# EasyEDA schematic Nixie Clock Main Board.json
TITLE: Sheet_1; REV: 1.0; Date: 2021-07-18; Sheet: 1/1; Drawn By: Gustavo Moraes; Company: Your Company
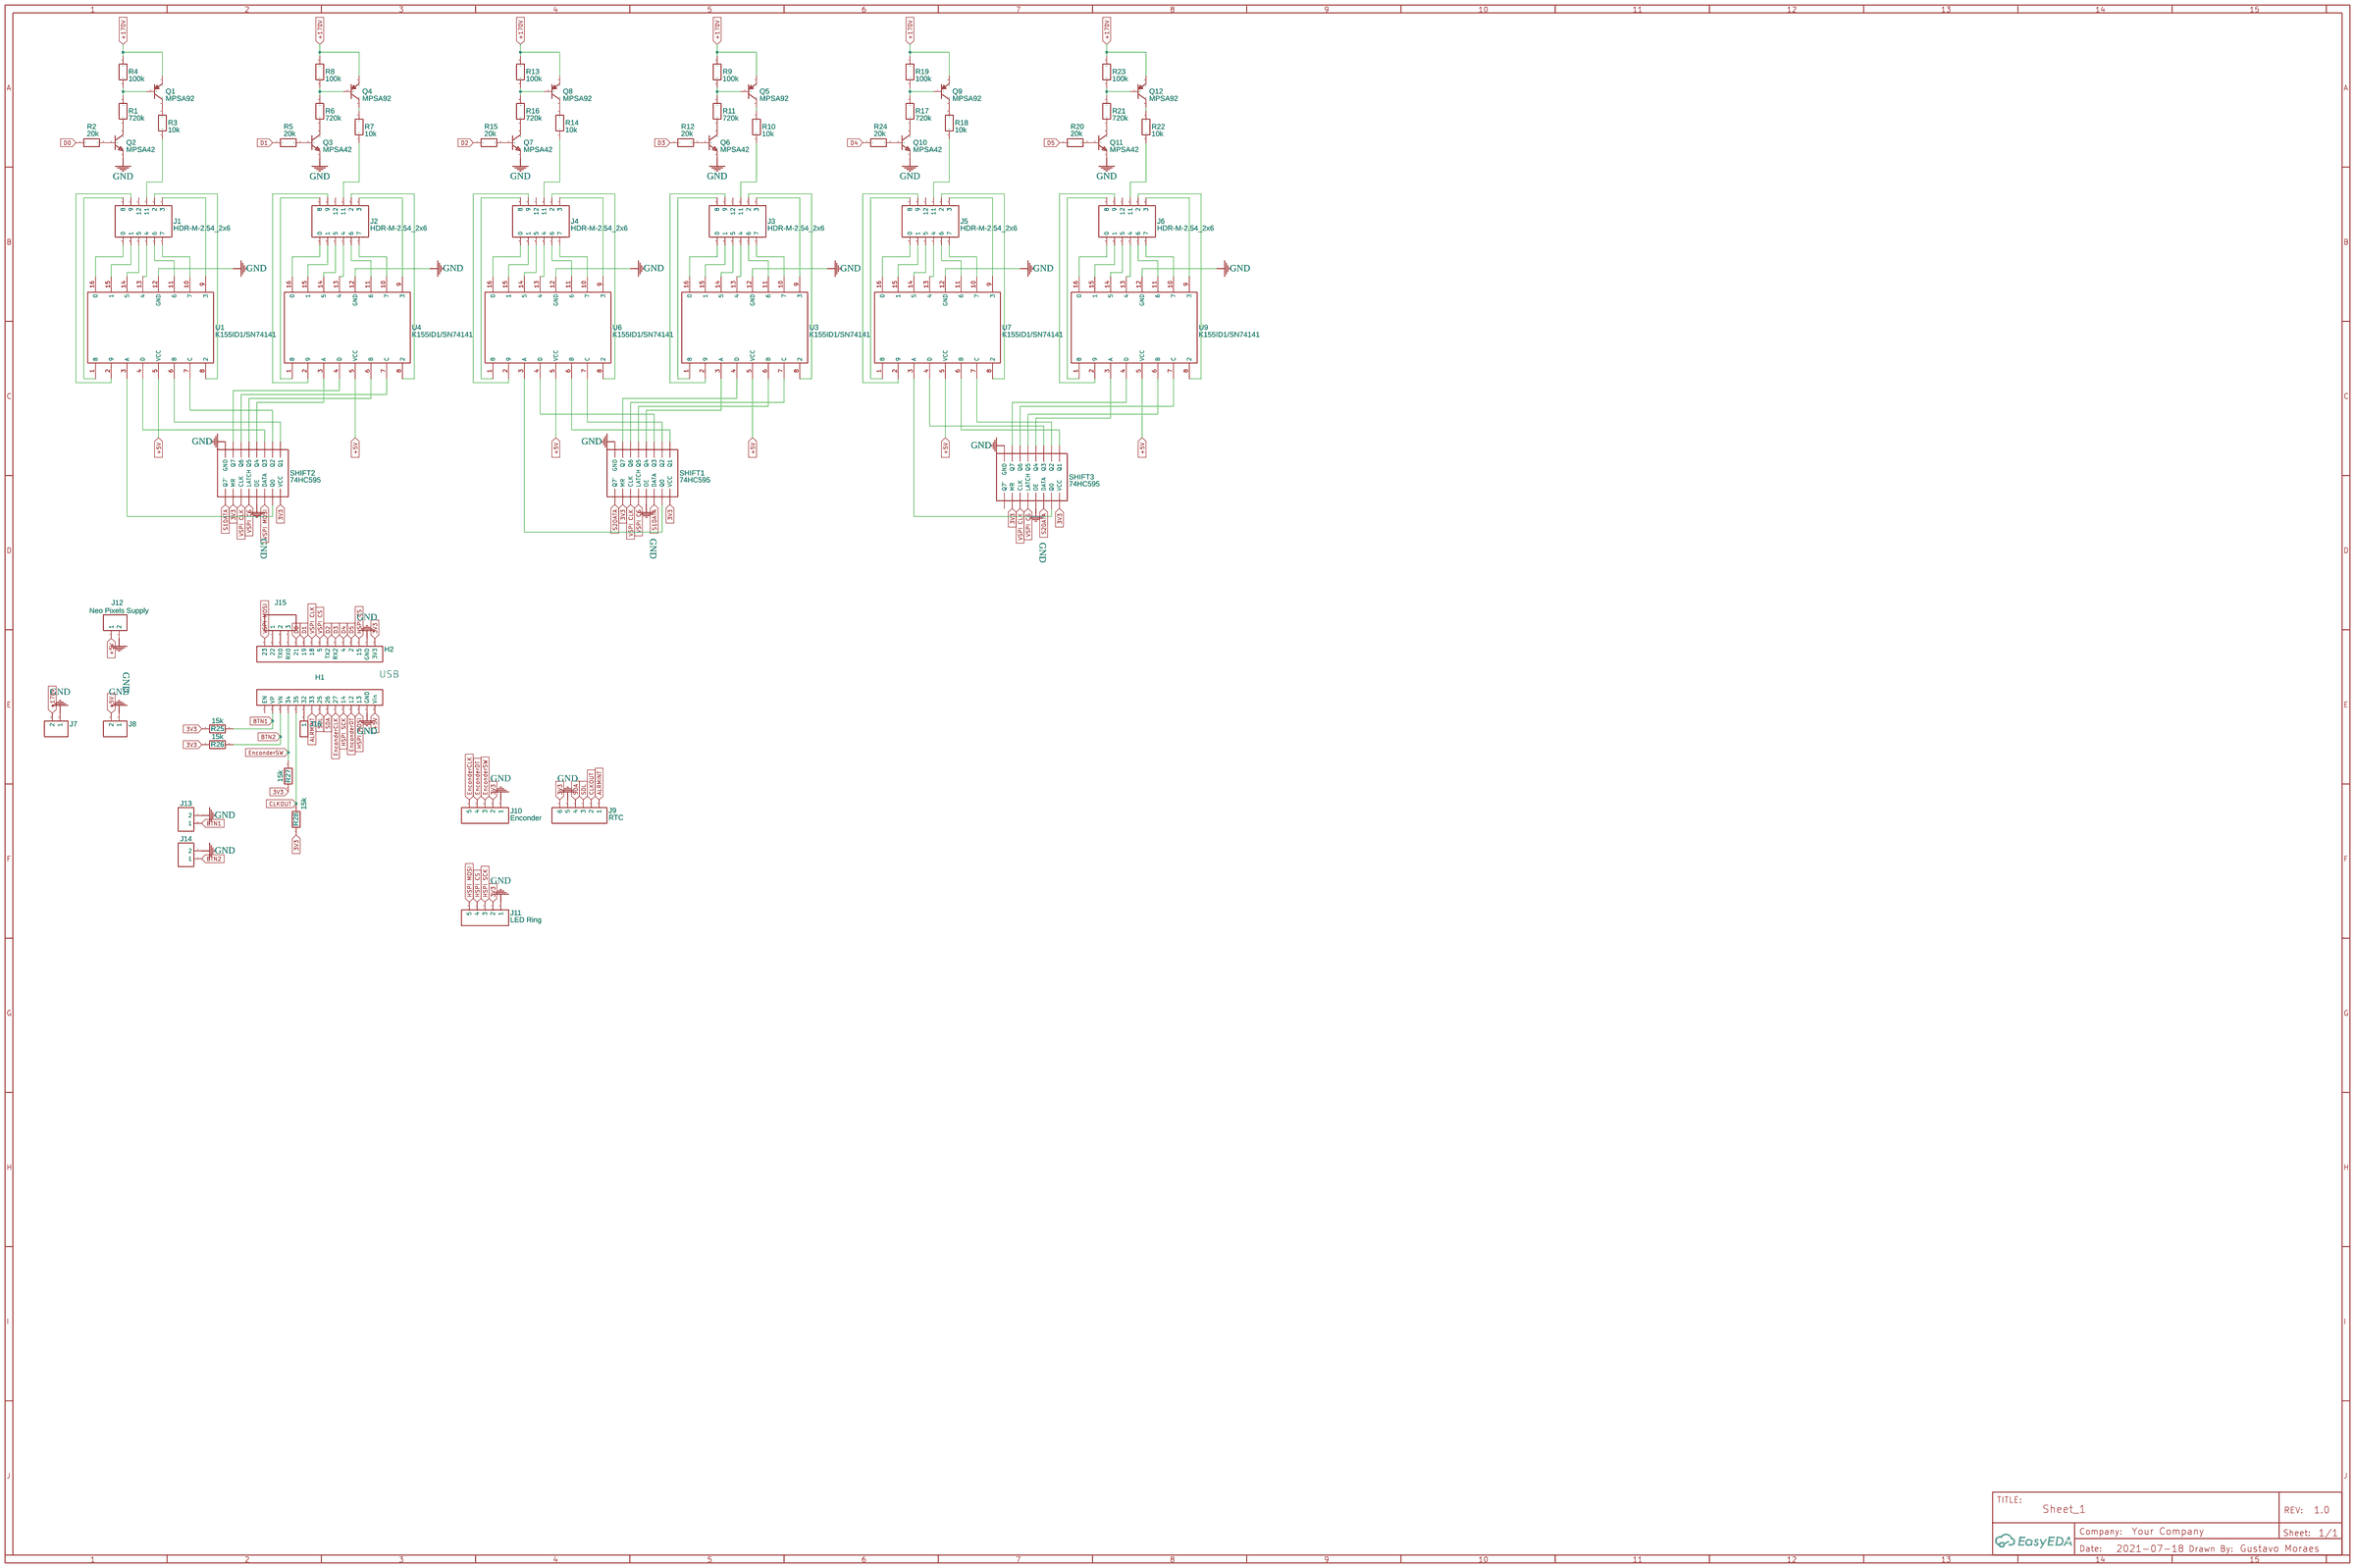
[diagram p0: schematic sheet]

## Parts
H1  HDR-F-2.54_1x15  [HDR-F-2.54_1X15]
H2  HDR-F-2.54_1x15  [HDR-F-2.54_1X15]
J1  HDR-M-2.54_2x6  [HDR-M-2.54_2X6]
J2  HDR-M-2.54_2x6  [HDR-M-2.54_2X6]
J3  HDR-M-2.54_2x6  [HDR-M-2.54_2X6]
J4  HDR-M-2.54_2x6  [HDR-M-2.54_2X6]
J5  HDR-M-2.54_2x6  [HDR-M-2.54_2X6]
J6  HDR-M-2.54_2x6  [HDR-M-2.54_2X6]
J7  HDR-M-2.54_1x2  [HDR-M-2.54_1X2]
J8  HDR-M-2.54_1x2  [HDR-M-2.54_1X2]
J9  RTC  [HDR-M-2.54_1X6]
J10  Enconder  [HDR-M-2.54_1X5]
J11  LED Ring  [HDR-M-2.54_1X5]
J12  Neo Pixels Supply  [HDR-M-2.54_1X2]
J13  HDR-M-2.54_1x2  [HDR-M-2.54_1X2]
J14  HDR-M-2.54_1x2  [HDR-M-2.54_1X2]
J15  HDR-M-2.54_1x3  [HDR-M-2.54_1X3]
J16  HDR-M-2.54_1x1  [HDR-M-2.54_1X1]
Q1  MPSA92  [TO-92-3_L5.1-W4.1-P1.27-L]
Q2  MPSA42  [TO-92-3_L4.9-W3.7-P1.27-L]
Q3  MPSA42  [TO-92-3_L4.9-W3.7-P1.27-L]
Q4  MPSA92  [TO-92-3_L5.1-W4.1-P1.27-L]
Q5  MPSA92  [TO-92-3_L5.1-W4.1-P1.27-L]
Q6  MPSA42  [TO-92-3_L4.9-W3.7-P1.27-L]
Q7  MPSA42  [TO-92-3_L4.9-W3.7-P1.27-L]
Q8  MPSA92  [TO-92-3_L5.1-W4.1-P1.27-L]
Q9  MPSA92  [TO-92-3_L5.1-W4.1-P1.27-L]
Q10  MPSA42  [TO-92-3_L4.9-W3.7-P1.27-L]
Q11  MPSA42  [TO-92-3_L4.9-W3.7-P1.27-L]
Q12  MPSA92  [TO-92-3_L5.1-W4.1-P1.27-L]
R1  720k  [R_AXIAL-0.3]
R2  20k  [R_AXIAL-0.3]
R3  10k  [R_AXIAL-0.3]
R4  100k  [R_AXIAL-0.3]
R5  20k  [R_AXIAL-0.3]
R6  720k  [R_AXIAL-0.3]
R7  10k  [R_AXIAL-0.3]
R8  100k  [R_AXIAL-0.3]
R9  100k  [R_AXIAL-0.3]
R10  10k  [R_AXIAL-0.3]
R11  720k  [R_AXIAL-0.3]
R12  20k  [R_AXIAL-0.3]
R13  100k  [R_AXIAL-0.3]
R14  10k  [R_AXIAL-0.3]
R15  20k  [R_AXIAL-0.3]
R16  720k  [R_AXIAL-0.3]
R17  720k  [R_AXIAL-0.3]
R18  10k  [R_AXIAL-0.3]
R19  100k  [R_AXIAL-0.3]
R20  20k  [R_AXIAL-0.3]
R21  720k  [R_AXIAL-0.3]
R22  10k  [R_AXIAL-0.3]
R23  100k  [R_AXIAL-0.3]
R24  20k  [R_AXIAL-0.3]
R25  15k  [R_AXIAL-0.3]
R26  15k  [R_AXIAL-0.3]
R27  15k  [R_AXIAL-0.3]
R28  15k  [R_AXIAL-0.3]
SHIFT1  74HC595  [DIP-16]
SHIFT2  74HC595  [DIP-16]
SHIFT3  74HC595  [DIP-16]
U1  K155ID1/SN74141  [DIP16]
U3  K155ID1/SN74141  [DIP16]
U4  K155ID1/SN74141  [DIP16]
U6  K155ID1/SN74141  [DIP16]
U7  K155ID1/SN74141  [DIP16]
U9  K155ID1/SN74141  [DIP16]

## Library data of the parts
H1 H2 = HDR-F-2.54_1x15: Supplier Part: C124408; Supplier: LCSC; Contributor: LCEDA_Lib
J1 J4 J5 = HDR-M-2.54_2x6: Supplier Part: C124388; Supplier: LCSC; Contributor: LCEDA_Lib; Package Display: No
J2 J3 J6 = HDR-M-2.54_2x6: Supplier Part: C124388; Supplier: LCSC; Contributor: LCEDA_Lib
J7 J8 J12-J14 = HDR-M-2.54_1x2: Supplier Part: C124375; Supplier: LCSC; Contributor: LCEDA_Lib
J9 = HDR-M-2.54_1x6: Supplier Part: C190819; Supplier: LCSC; Contributor: LCEDA_Lib
J10 J11 = HDR-M-2.54_1x5: Supplier Part: C358687; Supplier: LCSC; Contributor: LCEDA_Lib
J15 = HDR-M-2.54_1x3: Supplier Part: C180248; Supplier: LCSC; Contributor: LCEDA_Lib
J16 = HDR-M-2.54_1x1: Supplier Part: C81276; Supplier: LCSC; Contributor: LCEDA_Lib
Q1 Q4 Q5 Q8 Q9 Q12 = MPSA92: Supplier: LCSC; Manufacturer: SEMTECH; Supplier Part: C118558; JLCPCB Part Class: Extended Part
Q2 Q3 Q6 Q7 Q10 Q11 = MPSA42: Supplier: LCSC; Manufacturer: SEMTECH; Contributor: LCSC; Supplier Part: C118557; JLCPCB Part Class: Extended Part
R1-R28 = R_AXIAL-0.3_EU: Contributor: LCEDA_Lib
SHIFT1-SHIFT3 = 74HC595: Contributor: prizmi.linek
U1 U3 U4 U6 U7 U9 = K155ID1/SN74141: Contributor: Sjoertdb

## Nets
3V3: H2.1(3V3) J9.6 J10.2 J11.2 R25.2 R26.2 R27.1 R28.1 SHIFT1.10(MR) SHIFT1.16(VCC) SHIFT2.10(MR) SHIFT2.16(VCC) SHIFT3.10(MR) SHIFT3.16(VCC)
+5V: H1.15(Vin) J8.2 J12.1 U1.5(VCC) U3.5(VCC) U4.5(VCC) U6.5(VCC) U7.5(VCC) U9.5(VCC)
+170V: J7.2 Q1.1 Q4.1 Q5.1 Q8.1 Q9.1 Q12.1 R4.2 R8.2 R9.2 R13.2 R19.2 R23.2
GND: H1.14(GND) H2.2(GND) J7.1 J8.1 J9.5 J10.1 J11.1 J12.2 J13.2 J14.2 Q2.1(E) Q3.1(E) Q6.1(E) Q7.1(E) Q10.1(E) Q11.1(E) SHIFT1.8(GND) SHIFT1.13(OE) SHIFT2.8(GND) SHIFT2.13(OE) SHIFT3.8(GND) SHIFT3.13(OE) U1.12(GND) U3.12(GND) U4.12(GND) U6.12(GND) U7.12(GND) U9.12(GND)
ALRMINT: H1.7(33) J9.1
BTN1: H1.2(VP) J13.1 R25.1
BTN2: H1.3(VN) J14.1 R26.1
CLKOUT: H1.5(35) J9.2 R28.2
D0: H2.11(21) R2.1
D1: H2.10(19) R5.1
D2: H2.7(TX2) R15.1
D3: H2.6(RX2) R12.1
D4: H2.5(4) R24.1
D5: H2.4(2) R20.1
EnconderCLK: H1.10(27) J10.5
EnconderDT: H1.12 J10.4
EnconderSW: H1.4(34) J10.3 R27.2
HSPI CS: H2.3(15) J11.4
HSPI MOSI: H1.13 J11.5
HSPI SCK: H1.11(14) J11.3
S1DATA: SHIFT1.14(DATA) SHIFT2.9(Q7')
S2DATA: SHIFT1.9(Q7') SHIFT3.14(DATA)
SDA: H1.9(26) J9.4
SDL: H1.8(25) J9.3
VSPI CLK: H2.9(18) SHIFT1.11(CLK) SHIFT2.11(CLK) SHIFT3.11(CLK)
VSPI CS: H2.8(5) SHIFT1.12(LATCH) SHIFT2.12(LATCH) SHIFT3.12(LATCH)
VSPI MOSI: H2.15(23) SHIFT2.14(DATA)
Net-(H1-6): H1.6(32) J16.1
Net-(H2-12): H2.12(RX0) J15.3
Net-(H2-13): H2.13(TX0) J15.2
Net-(H2-14): H2.14(22) J15.1
Net-(J1-1): J1.1(3) U1.9(3)
Net-(J1-2): J1.2(7) U1.10(7)
Net-(J1-3): J1.3(2) U1.8(2)
Net-(J1-4): J1.4(6) U1.11(6)
Net-(J1-5): J1.5(11) R3.1
Net-(J1-6): J1.6(4) U1.13(4)
Net-(J1-8): J1.8(5) U1.14(5)
Net-(J1-9): J1.9 U1.2(9)
Net-(J1-10): J1.10(1) U1.15(1)
Net-(J1-11): J1.11(8) U1.1(8)
Net-(J1-12): J1.12(0) U1.16(0)
Net-(J2-1): J2.1(3) U4.9(3)
Net-(J2-2): J2.2(7) U4.10(7)
Net-(J2-3): J2.3(2) U4.8(2)
Net-(J2-4): J2.4(6) U4.11(6)
Net-(J2-5): J2.5(11) R7.1
Net-(J2-6): J2.6(4) U4.13(4)
Net-(J2-8): J2.8(5) U4.14(5)
Net-(J2-9): J2.9 U4.2(9)
Net-(J2-10): J2.10(1) U4.15(1)
Net-(J2-11): J2.11(8) U4.1(8)
Net-(J2-12): J2.12(0) U4.16(0)
Net-(J3-1): J3.1(3) U3.9(3)
Net-(J3-2): J3.2(7) U3.10(7)
Net-(J3-3): J3.3(2) U3.8(2)
Net-(J3-4): J3.4(6) U3.11(6)
Net-(J3-5): J3.5(11) R10.1
Net-(J3-6): J3.6(4) U3.13(4)
Net-(J3-8): J3.8(5) U3.14(5)
Net-(J3-9): J3.9 U3.2(9)
Net-(J3-10): J3.10(1) U3.15(1)
Net-(J3-11): J3.11(8) U3.1(8)
Net-(J3-12): J3.12(0) U3.16(0)
Net-(J4-1): J4.1(3) U6.9(3)
Net-(J4-2): J4.2(7) U6.10(7)
Net-(J4-3): J4.3(2) U6.8(2)
Net-(J4-4): J4.4(6) U6.11(6)
Net-(J4-5): J4.5(11) R14.1
Net-(J4-6): J4.6(4) U6.13(4)
Net-(J4-8): J4.8(5) U6.14(5)
Net-(J4-9): J4.9 U6.2(9)
Net-(J4-10): J4.10(1) U6.15(1)
Net-(J4-11): J4.11(8) U6.1(8)
Net-(J4-12): J4.12(0) U6.16(0)
Net-(J5-1): J5.1(3) U7.9(3)
Net-(J5-2): J5.2(7) U7.10(7)
Net-(J5-3): J5.3(2) U7.8(2)
Net-(J5-4): J5.4(6) U7.11(6)
Net-(J5-5): J5.5(11) R18.1
Net-(J5-6): J5.6(4) U7.13(4)
Net-(J5-8): J5.8(5) U7.14(5)
Net-(J5-9): J5.9 U7.2(9)
Net-(J5-10): J5.10(1) U7.15(1)
Net-(J5-11): J5.11(8) U7.1(8)
Net-(J5-12): J5.12(0) U7.16(0)
Net-(J6-1): J6.1(3) U9.9(3)
Net-(J6-2): J6.2(7) U9.10(7)
Net-(J6-3): J6.3(2) U9.8(2)
Net-(J6-4): J6.4(6) U9.11(6)
Net-(J6-5): J6.5(11) R22.1
Net-(J6-6): J6.6(4) U9.13(4)
Net-(J6-8): J6.8(5) U9.14(5)
Net-(J6-9): J6.9 U9.2(9)
Net-(J6-10): J6.10(1) U9.15(1)
Net-(J6-11): J6.11(8) U9.1(8)
Net-(J6-12): J6.12(0) U9.16(0)
Net-(Q1-2): Q1.2 R1.2 R4.1
Net-(Q1-3): Q1.3 R3.2
Net-(Q2-2): Q2.2(B) R2.2
Net-(Q2-3): Q2.3(C) R1.1
Net-(Q3-2): Q3.2(B) R5.2
Net-(Q3-3): Q3.3(C) R6.1
Net-(Q4-2): Q4.2 R6.2 R8.1
Net-(Q4-3): Q4.3 R7.2
Net-(Q5-2): Q5.2 R9.1 R11.2
Net-(Q5-3): Q5.3 R10.2
Net-(Q6-2): Q6.2(B) R12.2
Net-(Q6-3): Q6.3(C) R11.1
Net-(Q7-2): Q7.2(B) R15.2
Net-(Q7-3): Q7.3(C) R16.1
Net-(Q8-2): Q8.2 R13.1 R16.2
Net-(Q8-3): Q8.3 R14.2
Net-(Q9-2): Q9.2 R17.2 R19.1
Net-(Q9-3): Q9.3 R18.2
Net-(Q10-2): Q10.2(B) R24.2
Net-(Q10-3): Q10.3(C) R17.1
Net-(Q11-2): Q11.2(B) R20.2
Net-(Q11-3): Q11.3(C) R21.1
Net-(Q12-2): Q12.2 R21.2 R23.1
Net-(Q12-3): Q12.3 R22.2
Net-(SHIFT1-1): SHIFT1.1(Q1) U6.6(B)
Net-(SHIFT1-2): SHIFT1.2(Q2) U6.7(C)
Net-(SHIFT1-3): SHIFT1.3(Q3) U6.4(D)
Net-(SHIFT1-4): SHIFT1.4(Q4) U3.3(A)
Net-(SHIFT1-5): SHIFT1.5(Q5) U3.6(B)
Net-(SHIFT1-6): SHIFT1.6(Q6) U3.7(C)
Net-(SHIFT1-7): SHIFT1.7(Q7) U3.4(D)
Net-(SHIFT1-15): SHIFT1.15(Q0) U6.3(A)
Net-(SHIFT2-1): SHIFT2.1(Q1) U1.6(B)
Net-(SHIFT2-2): SHIFT2.2(Q2) U1.7(C)
Net-(SHIFT2-3): SHIFT2.3(Q3) U1.4(D)
Net-(SHIFT2-4): SHIFT2.4(Q4) U4.3(A)
Net-(SHIFT2-5): SHIFT2.5(Q5) U4.6(B)
Net-(SHIFT2-6): SHIFT2.6(Q6) U4.7(C)
Net-(SHIFT2-7): SHIFT2.7(Q7) U4.4(D)
Net-(SHIFT2-15): SHIFT2.15(Q0) U1.3(A)
Net-(SHIFT3-1): SHIFT3.1(Q1) U7.6(B)
Net-(SHIFT3-2): SHIFT3.2(Q2) U7.7(C)
Net-(SHIFT3-3): SHIFT3.3(Q3) U7.4(D)
Net-(SHIFT3-4): SHIFT3.4(Q4) U9.3(A)
Net-(SHIFT3-5): SHIFT3.5(Q5) U9.6(B)
Net-(SHIFT3-6): SHIFT3.6(Q6) U9.7(C)
Net-(SHIFT3-7): SHIFT3.7(Q7) U9.4(D)
Net-(SHIFT3-15): SHIFT3.15(Q0) U7.3(A)

Not connected (* = marked no-connect by the designer): H1 1(EN); J1 7(12); J2 7(12); J3 7(12); J4 7(12); J5 7(12); J6 7(12); SHIFT3 9(Q7')

## Notes on the sheet
- USB
